# Altium project FEV-60.PrjPcb
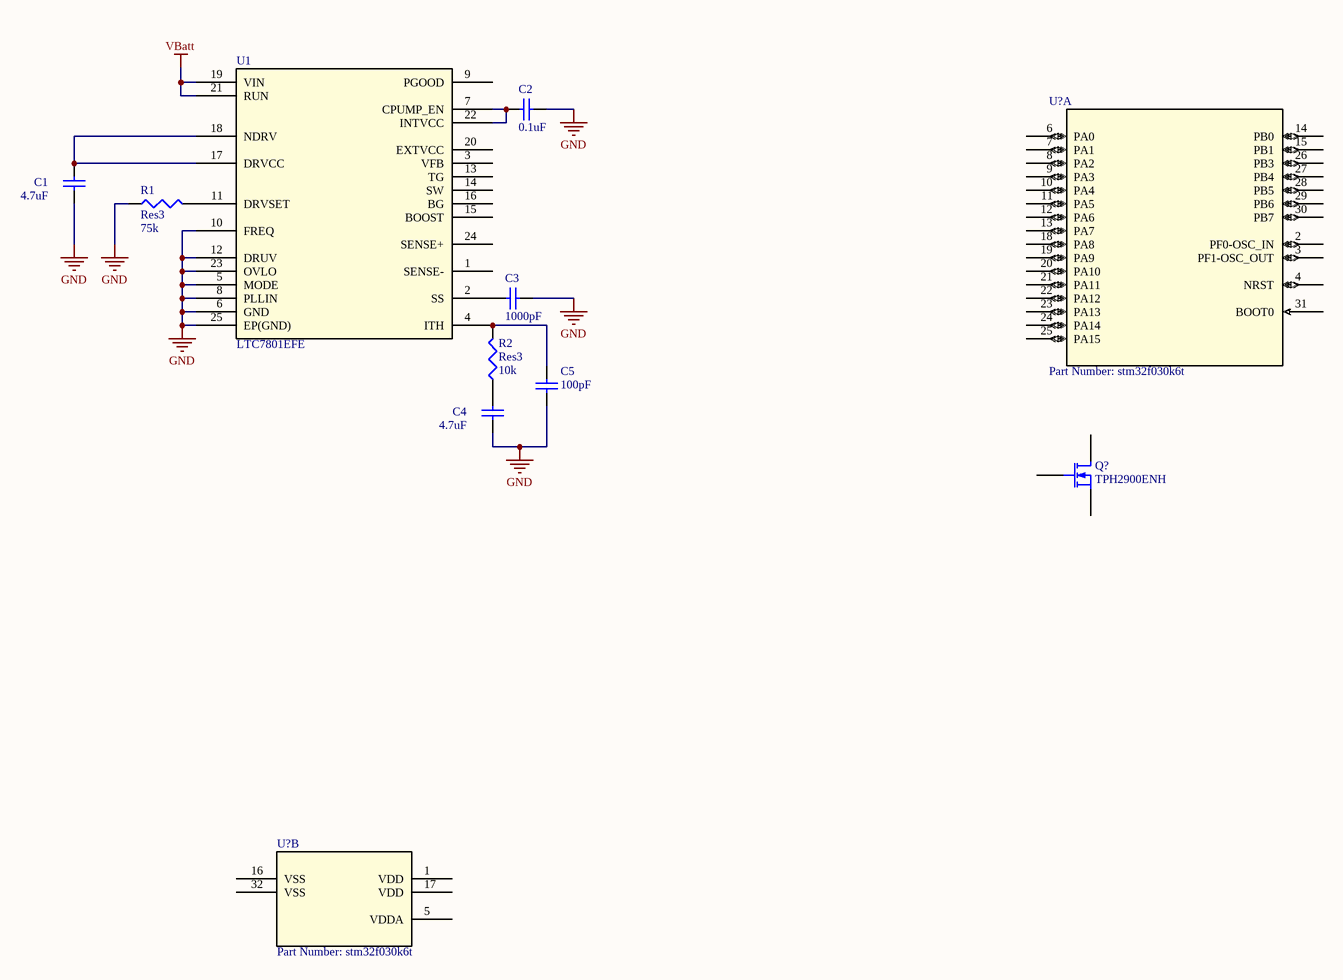
[diagram p0: FEV-60_Motor_Driver.SchDoc]
Rev: A0
3 sheets, 13 parts. Net scope: global (net labels, ports and power ports of the same name join across sheets).
Sheets:
  FEV-60_Top.SchDoc
  FEV-60_Motor_Driver.SchDoc
  FEV-60_IO_Board.SchDoc

## Sheet FEV-60_Top.SchDoc
size B; Revision: A0

### Notes on the sheet
- Title
- Date:
- Revision:
- Number:
- Team Skytanic
- Sheet
- of
- Senior Design
- 2019/2020
- File:

## Sheet FEV-60_Motor_Driver.SchDoc
size B; Revision: A0

### Parts
(Parts that share a designator on the sheet are numbered #1, #2 ... from top to bottom, then left to right.)
C1  value 4.7uF  [1608[0603]]  (hidden comment: Cap Semi)
C2  value 0.1uF  [1608[0603]]  (hidden comment: Cap Semi)
C3  value 1000pF  [1608[0603]]  (hidden comment: Cap Semi)
C4  value 4.7uF  [1608[0603]]  (hidden comment: Cap Semi)
C5  value 100pF  [1608[0603]]  (hidden comment: Cap Semi)
Q?  TPH2900ENH
R1  Res3  value 75k  [J1-0603]
R2  Res3  value 10k  [J1-0603]
U1  LTC7801EFE  [LTC7801]
U?#1  Part Number: stm32f030k6t  [LQFP-32]  (part A of 2)
U?#2  Part Number: stm32f030k6t  [LQFP-32]  (part B of 2)

### Nets
GND: C1.1 C2.1 C3.1 C4.1 C5.1 R1.1 U1.5(MODE) U1.6(GND) U1.8(PLLIN) U1.10(FREQ) U1.12(DRUV) U1.23(OVLO) U1.25(EP(GND))
VBatt: U1.19(VIN) U1.21(RUN)
NetC1_2: C1.2 U1.17(DRVCC) U1.18(NDRV)
NetC2_2: C2.2 U1.7(CPUMP_EN) U1.22(INTVCC)
NetC3_2: C3.2 U1.2(SS)
NetC4_2: C4.2 R2.1
NetC5_2: C5.2 R2.2 U1.4(ITH)
NetR1_2: R1.2 U1.11(DRVSET)

Not connected (* = marked no-connect by the designer): Q? 1(D) 2(G) 3(S); U1 1(SENSE-) 3(VFB) 9(PGOOD) 13(TG) 14(SW) 15(BOOST) 16(BG) 20(EXTVCC) 24(SENSE+); U?#1 2(PF0-OSC_IN) 3(PF1-OSC_OUT) 4(NRST) 6(PA0) 7(PA1) 8(PA2) 9(PA3) 10(PA4) 11(PA5) 12(PA6) 13(PA7) 14(PB0) 15(PB1) 18(PA8) 19(PA9) 20(PA10) 21(PA11) 22(PA12) 23(PA13) 24(PA14) 25(PA15) 26(PB3) 27(PB4) 28(PB5) 29(PB6) 30(PB7) 31(BOOT0); U?#2 1(VDD) 5(VDDA) 16(VSS) 17(VDD) 32(VSS)

### Notes on the sheet
- Title
- Date:
- Revision:
- Number:
- Team Skytanic
- Sheet
- of
- Senior Design
- 2019/2020
- File:

### Library data of the parts
C1-C5 = Cap Semi: Capacitor (Semiconductor SIM Model); Published: 8-Jun-2000; LatestRevisionDate: 29-May-2009; LatestRevisionNote: IPC-7351 Footprint Added.; PackageReference: C1206; Publisher: Altium Limited; PackageDescription: Chip Capacitor
Q? = TPH2900ENH: Manufacturer: Toshiba; Part Number: TPH2900ENHL1QCT-ND; ComponentLink1Description: TPH2900ENH; ComponentLink1URL: https://www.digikey.com/product-detail/en/toshiba-semiconductor-and-storage/TPH2900ENHL1Q/TPH2900ENHL1QCT-ND/5456291
R1 R2 = Res3: Resistor; Published: 8-Jun-2000; LatestRevisionDate: 29-May-2009; LatestRevisionNote: IPC-7351 Footprint Added.; PackageReference: J1-0603; Publisher: Altium Limited; PackageDescription: Chip Resistor
U1 = LTC7801EFE: Buck Regulator Positive Output Step-Down DC-DC Controller IC 24-TSSOP; Manufacturer: Analog Devices; Part Number: LTC7801EFE#PBF; Copyright: Copyright (C) 2018 Accelerated Designs. All rights reserved; RefDes: RefDes; Type: DEV; Value: Value
U?#1 U?#2 = STM32F030K6T: No Description Available; Manufacturer: STMicroelectronics; Copyright: Copyright (C) 2016 Accelerated Designs. All rights reserved; RefDes: RefDes; Type: DEV; Value: Value

## Sheet FEV-60_IO_Board.SchDoc
size B
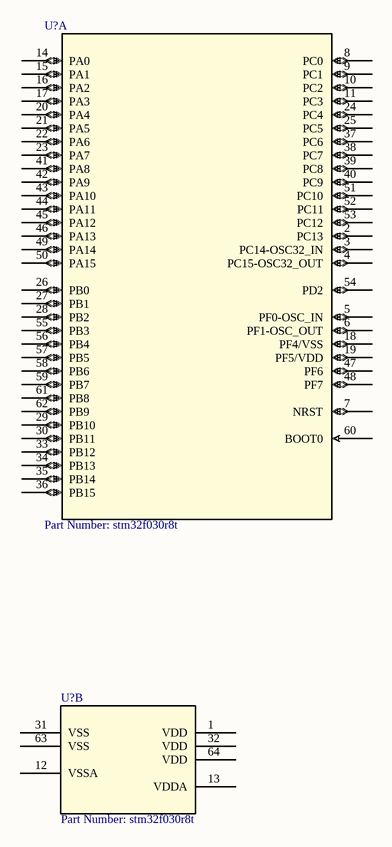
[diagram p1: FEV-60_IO_Board.SchDoc]

### Parts
(Parts that share a designator on the sheet are numbered #1, #2 ... from top to bottom, then left to right.)
U?#3  Part Number: stm32f030r8t  [LQFP64-10x10mm]  (part A of 2)
U?#4  Part Number: stm32f030r8t  [LQFP64-10x10mm]  (part B of 2)

### Nets

Not connected (* = marked no-connect by the designer): U?#3 2(PC13) 3(PC14-OSC32_IN) 4(PC15-OSC32_OUT) 5(PF0-OSC_IN) 6(PF1-OSC_OUT) 7(NRST) 8(PC0) 9(PC1) 10(PC2) 11(PC3) 14(PA0) 15(PA1) 16(PA2) 17(PA3) 18(PF4/VSS) 19(PF5/VDD) 20(PA4) 21(PA5) 22(PA6) 23(PA7) 24(PC4) 25(PC5) 26(PB0) 27(PB1) 28(PB2) 29(PB10) 30(PB11) 33(PB12) 34(PB13) 35(PB14) 36(PB15) 37(PC6) 38(PC7) 39(PC8) 40(PC9) 41(PA8) 42(PA9) 43(PA10) 44(PA11) 45(PA12) 46(PA13) 47(PF6) 48(PF7) 49(PA14) 50(PA15) 51(PC10) 52(PC11) 53(PC12) 54(PD2) 55(PB3) 56(PB4) 57(PB5) 58(PB6) 59(PB7) 60(BOOT0) 61(PB8) 62(PB9); U?#4 1(VDD) 12(VSSA) 13(VDDA) 31(VSS) 32(VDD) 63(VSS) 64(VDD)

### Notes on the sheet
- Title
- Date:
- Revision:
- Number:
- Team Skytanic
- Sheet
- of
- Senior Design
- 2019/2020
- File:

### Library data of the parts
U?#3 U?#4 = STM32F030R8T: No Description Available; Manufacturer: STMicroelectronics; Copyright: Copyright (C) 2016 Accelerated Designs. All rights reserved; RefDes: RefDes; Type: DEV; Value: Value